# EAGLE design revA (EAGLE 5.11)
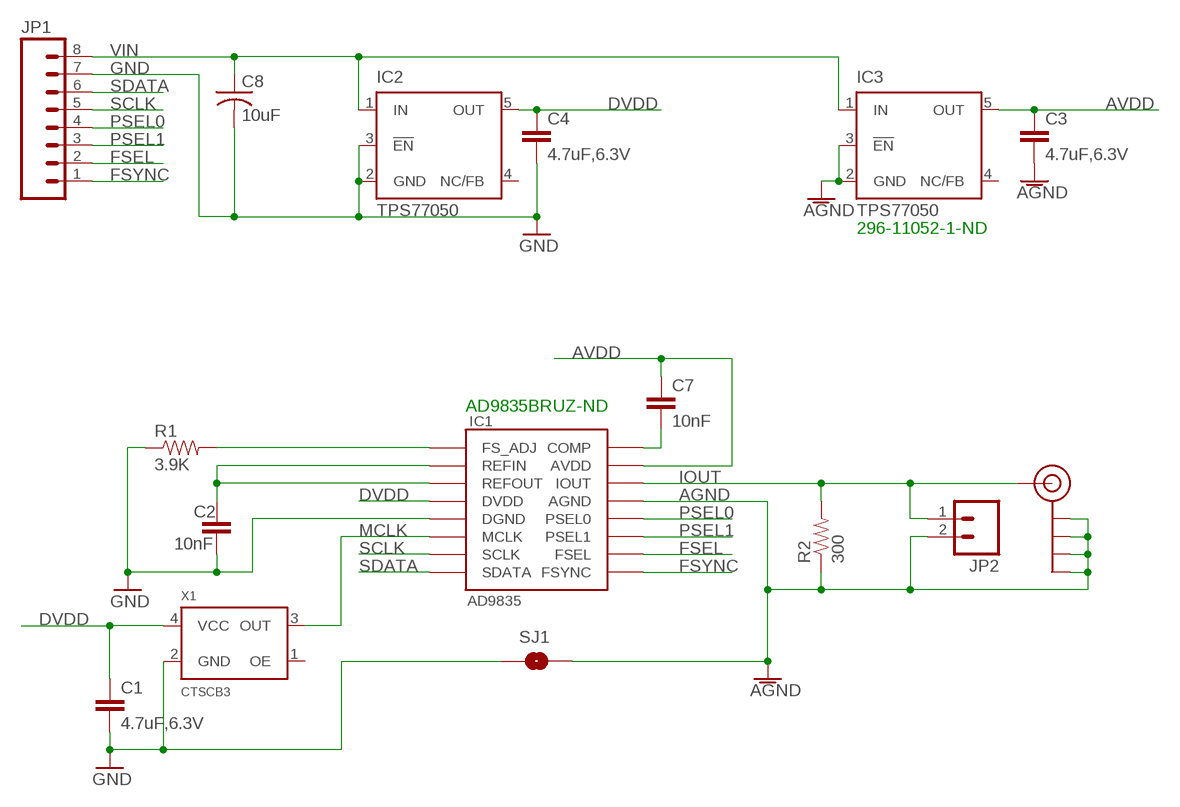
[diagram p0: schematic, sheet 1]

## Parts
C1  4.7uF,6.3V  CAP0402  [C0402]
C2  10nF  CAP0402  [C0402]
C3  4.7uF,6.3V  CAP0402  [C0402]
C4  4.7uF,6.3V  CAP0402  [C0402]
C7  10nF  CAP0402  [C0402]
C8  10uF  C-USC0805K  [C0805K]
IC1  AD9835  [TSSOP16]
IC2  TPS77050  [SOT23-DBV]
IC3  TPS77050  [SOT23-DBV]
J$1  SMA_EDGE  [SMA-EDGE]
JP1  M08  [1X08]
JP2  M02PTH  [1X02]
R1  3.9K  RESISTOR0402  [C0402]
R2  300  RESISTOR0402  [C0402]
SJ1  SOLDERJUMPERTRACE  [SJ_2S-TRACE]
X1  CTSCB3  [CTS*CB3]

## Nets
AGND: C3.2 IC1.13(AGND) IC3.2(GND) IC3.3(!EN) J$1.GND@0(GND) J$1.GND@1(GND) J$1.GND@2(GND) J$1.GND@3(GND) JP2.2 R2.1 SJ1.2
AVDD: C3.1 C7.1 IC1.15(AVDD) IC3.5(OUT)
DVDD: C1.1 C4.1 IC1.4(DVDD) IC2.5(OUT) X1.4(VCC)
FSEL: IC1.10(FSEL) JP1.2
FSYNC: IC1.9(FSYNC) JP1.1
GND: C1.2 C2.2 C4.2 C8.2 IC1.5(DGND) IC2.2(GND) IC2.3(!EN) JP1.7 R1.1 SJ1.1 X1.2(GND)
IOUT: IC1.14(IOUT) J$1.SIG(SIGNAL) JP2.1 R2.2
MCLK: IC1.6(MCLK) X1.3(OUT)
N$1: IC1.1(FS_ADJ) R1.2
N$2: C2.1 IC1.2(REFIN) IC1.3(REFOUT)
N$4: C7.2 IC1.16(COMP)
PSEL0: IC1.12(PSEL0) JP1.4
PSEL1: IC1.11(PSEL1) JP1.3
SCLK: IC1.7(SCLK) JP1.5
SDATA: IC1.8(SDATA) JP1.6
VIN: C8.1 IC2.1(IN) IC3.1(IN) JP1.8
Unconnected: IC2.4(NC/FB) IC3.4(NC/FB) X1.1(OE)

## Notes on the sheet
- 296-11052-1-ND
- AD9835BRUZ-ND

## Library data of the parts
C1-C4 C7 = SparkFun:CAP: Capacitor Standard 0603 ceramic capacitor, and 0.1" leaded capacitor.
C8 = adafruit:C-US: CAPACITOR, American symbol
IC1 = SparkFun:AD9835
IC2 IC3 = texas:TPS770*: ULTRALOW-POWER 50-mA LOW-DROPOUT LINEAR REGULATORS 50-mA Low-Dropout Regulator Source: http://focus.ti.com/lit/ds/symlink/tps77001.pdf; MF: TEXAS INSTRUMENT CONNECTORS; MPN: TPS77050DBVT; OC_FARNELL: 1412883; OC_NEWARK: 77C1189
J$1 = SparkFun:SMA_EDGE: SMA Antenna Connector End launch SMA connector. The paste layer has been removed so that the connector can be hand soldered onto the board after reflow.
JP1 = SparkFun:M08: Header 8 Standard 8-pin 0.1" header. Use with straight break away headers (SKU : PRT-00116), right angle break away headers (PRT-00553), swiss pins (PRT-00743), machine pins (PRT-00117), and female headers (PRT-00115).
JP2 = SparkFun:M02: Header 2 Standard 2-pin 0.1" header. Use with straight break away headers (SKU : PRT-00116), right angle break away headers (PRT-00553), swiss pins (PRT-00743), machine pins (PRT-00117), and female headers (PRT-00115). Molex polarized connector foot print use with SKU : PRT-08233 with associated crimp pins and housings.
R1 R2 = SparkFun:RESISTOR: Resistor Basic schematic elements and footprints for 0603, 1206, and PTH 1/10th watt (small) resistors.
SJ1 = SparkFun:SOLDERJUMPER: Solder Jumper Standard SMD solder jumper. Used to automate production. Two varients : Normally Open and Normally Closed are the same, but have different paste layers. NC will have a large amount of paste and should jumper during reflow.
X1 = crystal:CTS*CB3: Model CB3 & CB3LV HCMOS/TTL Clock Oscillator

## Board
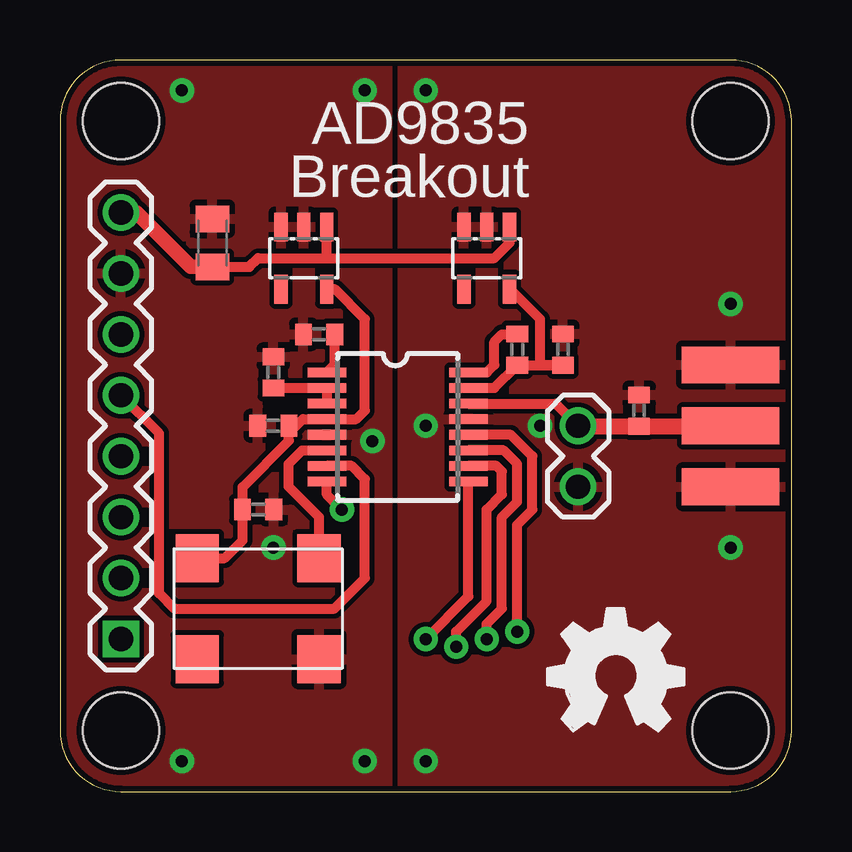
[diagram p1: board, top side]
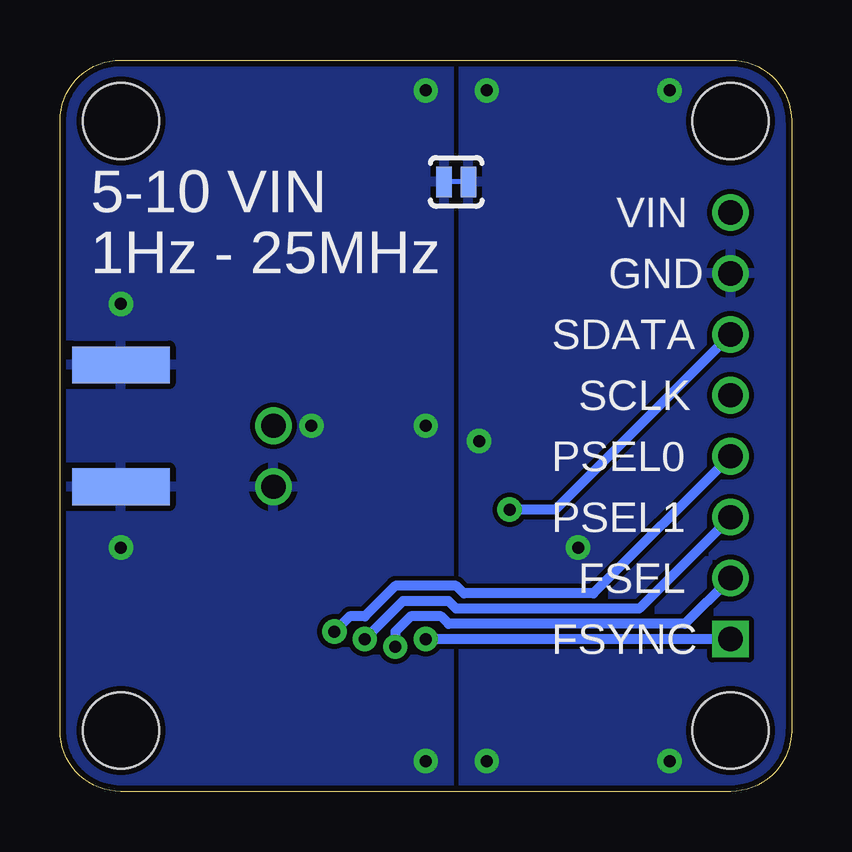
[diagram p2: board, bottom side, seen from below]

Size 30.48 x 30.48 mm. Coordinates in mm from the lower left corner, seen from the top.
Outline: 30.48,27.94 arc90 27.94,30.48 2.54,30.48 arc90 0,27.94 0,2.54 arc90 2.54,0 27.94,0 arc90 30.48,2.54 30.48,27.94
Copper layers (1*16): Top 0.035mm / dielectric 1.5mm / Bottom 0.035mm
Design rules "ITead_rule": minimum track width 8mil, minimum drill 12mil, track to track 8mil, track to pad 8mil, pad to pad 8mil, via to via 8mil, smd to smd 8mil, copper to edge 10mil, drill to drill 10mil, minimum pad ring 10mil, minimum via ring 6mil, stop-mask expansion 2mil, vias tented up to drill 100mil, thermal gap 10mil
Holes 3.17 mm at 2.54,2.54 2.54,27.94 27.94,27.94 27.94,2.54

### Footprints (pad centres in the part's own frame; a part is rotated, then mirrored left to right if it is on the bottom)
C0402 = smd 0.7 x 0.9: 1 -0.65,0; 2 0.65,0
C0805K = smd 1.1 x 1.4: 1 -1,0; 2 1,0
TSSOP16 = smd 0.4 x 1.6: 1 -2.225,-2.85; 2 -1.575,-2.85; 3 -0.925,-2.85; 4 -0.275,-2.85; 5 0.375,-2.85; 6 1.025,-2.85; 7 1.675,-2.85; 8 2.325,-2.85; 9 2.325,3.05; 10 1.675,3.05; 11 1.025,3.05; 12 0.375,3.05; 13 -0.275,3.05; 14 -0.925,3.05; 15 -1.575,3.05; 16 -2.225,3.05
SOT23-DBV = smd 0.55 x 1.2: 1 -0.95,-1.3; 2 0,-1.3; 3 0.95,-1.3; 4 0.95,1.3; 5 -0.95,1.3
SMA-EDGE = smd 1.524 x 4.064: GND@0 0,0; GND@1 5.08,0; SIG 2.54,0 | smd 1.524 x 4.064 bottom: GND@2 0,0; GND@3 5.08,0
1X08 = drill 1.016 square: 1 0,0 | drill 1.016 round: 2 2.54,0; 3 5.08,0; 4 7.62,0; 5 10.16,0; 6 12.7,0; 7 15.24,0; 8 17.78,0
1X02 = drill 1.016 round: 1 0,0; 2 2.54,0
SJ_2S-TRACE = smd 0.635 x 1.27: 1 -0.508,0; 2 0.508,0
CTS*CB3 = smd 1.8 x 2: 1 -2.54,-2.1; 2 2.54,-2.1; 3 2.54,2.1; 4 -2.54,2.1

### Placement (x,y rotation side)
C1  8.26,11.75 0 top
C2  8.89,17.46 90 top
C3  20.95,18.41 90 top
C4  8.89,15.24 180 top
C7  19.05,18.41 90 top
C8  6.35,22.86 90 top
IC1  13.97,15.24 270 top
IC2  10.16,22.23 180 top
IC3  17.78,22.23 180 top
J$1  27.94,12.7 90 top
JP1  2.54,6.35 90 top
JP2  21.59,15.24 270 top
R1  10.79,19.05 0 top
R2  24.13,15.88 270 top
SJ1  13.97,25.4 180 bottom
U$1  [OSHW_FILLX200_NOTEXT]  20.32,2.54 0 top
X1  8.26,7.62 0 top

### Tracks (layer width: path | path; a pad name or v marks a point on that pad's centre or on a via)
AGND  (via drill 0.5 pad 1.02)
  other vias: 27.94,10.16 20,15.24 27.94,20.32 15.24,1.27 15.24,29.21 15.24,15.24
  pour Top (isolate 0.203): 30.48,0 14.29,0 14.29,30.48 30.48,30.48
  pour Bottom (isolate 0.203): 30.48,0 30.48,30.48 14.29,30.48 14.29,0
AVDD
  Top 0.406: IC1.15 18.1,16.82 C7.1 C3.1 20.02,17.77 20,17.78 20,19.68 18.76,20.93 IC3.5
DVDD
  Top 0.406: X1.4 6.86,9.72 7.61,10.46 C1.1 7.61,12.69 9.54,14.62 C4.1 9.84,15.24 10.12,15.52 IC1.4 12.34,15.52 12.7,15.88 12.7,19.68 11.46,20.93 IC2.5
FSEL  (via drill 0.5 pad 1.02)
  Top 0.406: IC1.10 18.18,13.56 18.41,13.34 18.41,12.38 17.78,11.75 17.78,7.94 16.51,6.67 v16.51,6.03
  Bottom 0.406: v16.51,6.03 16.51,6.67 15.88,7.3 14.61,7.3 14.29,6.99 4.45,6.99 JP1.2
FSYNC  (via drill 0.5 pad 1.02)
  Top 0.406: IC1.9 17.02,8.13 v15.24,6.35
  Bottom 0.406: JP1.1 v15.24,6.35
GND  (via drill 0.5 pad 1.02)
  other vias: 5.08,1.27 13.02,14.61 8.89,10.16 12.7,1.27 12.7,29.21 5.08,29.21
  pour Top (isolate 0.203): 0,0 13.65,0 13.65,30.48 0,30.48
  pour Bottom (isolate 0.203): 0,0 13.65,0 13.65,30.48 0,30.48
IOUT
  Top 0.406: IC1.14 20.66,16.16 JP2.1
  Top 0.66: J$1.SIG 27.93,15.22 R2.2 21.61,15.22 JP2.1
MCLK
  Top 0.406: IC1.6 10.09,14.21 9.53,13.65 9.53,12.7 10.79,11.43 X1.3
N$1
  Top 0.406: IC1.1 11.45,17.8 R1.2
N$2
  Top 0.406: C2.1 IC1.2 IC1.3
N$4
  Top 0.406: IC1.16 17.78,17.46 18.1,17.78 18.1,18.73 18.41,19.05 C7.2
PSEL0  (via drill 0.5 pad 1.02)
  Top 0.406: IC1.12 18.79,14.87 19.68,13.97 19.68,11.75 19.05,11.11 v19.05,6.67
  Bottom 0.406: JP1.4 8.26,8.26 13.65,8.26 13.97,8.57 16.51,8.57 17.78,7.3 18.41,7.3 v19.05,6.67
PSEL1  (via drill 0.5 pad 1.02)
  Top 0.406: IC1.11 18.49,14.21 19.05,13.65 19.05,12.06 18.41,11.43 18.41,7.62 17.78,6.99 v17.78,6.35
  Bottom 0.406: v17.78,6.35 16.19,7.94 14.29,7.94 13.97,7.62 6.35,7.62 JP1.3
SCLK
  Top 0.406: IC1.7 12.15,13.56 12.7,13.02 12.7,8.89 11.43,7.62 4.76,7.62 4.13,8.26 4.13,14.92 JP1.5
SDATA  (via drill 0.5 pad 1.02)
  Top 0.406: IC1.8 11.12,12.38 v11.75,11.75
  Bottom 0.406: JP1.6 9.84,11.75 v11.75,11.75
VIN
  Top 0.406: C8.1 7.89,21.86 8.26,22.23 11.11,22.23 | 11.11,22.23 18.1,22.23 18.73,22.86 IC3.1 | IC2.1 11.11,22.23
  Top 0.61: JP1.8 3.17,24.13 5.45,21.86 C8.1

### Text on the board
tPlace: AD9835 | Breakout
bPlace: 5-10 VIN | VIN | 1Hz - 25MHz | GND | SDATA | SCLK | PSEL0 | PSEL1 | FSEL | FSYNC